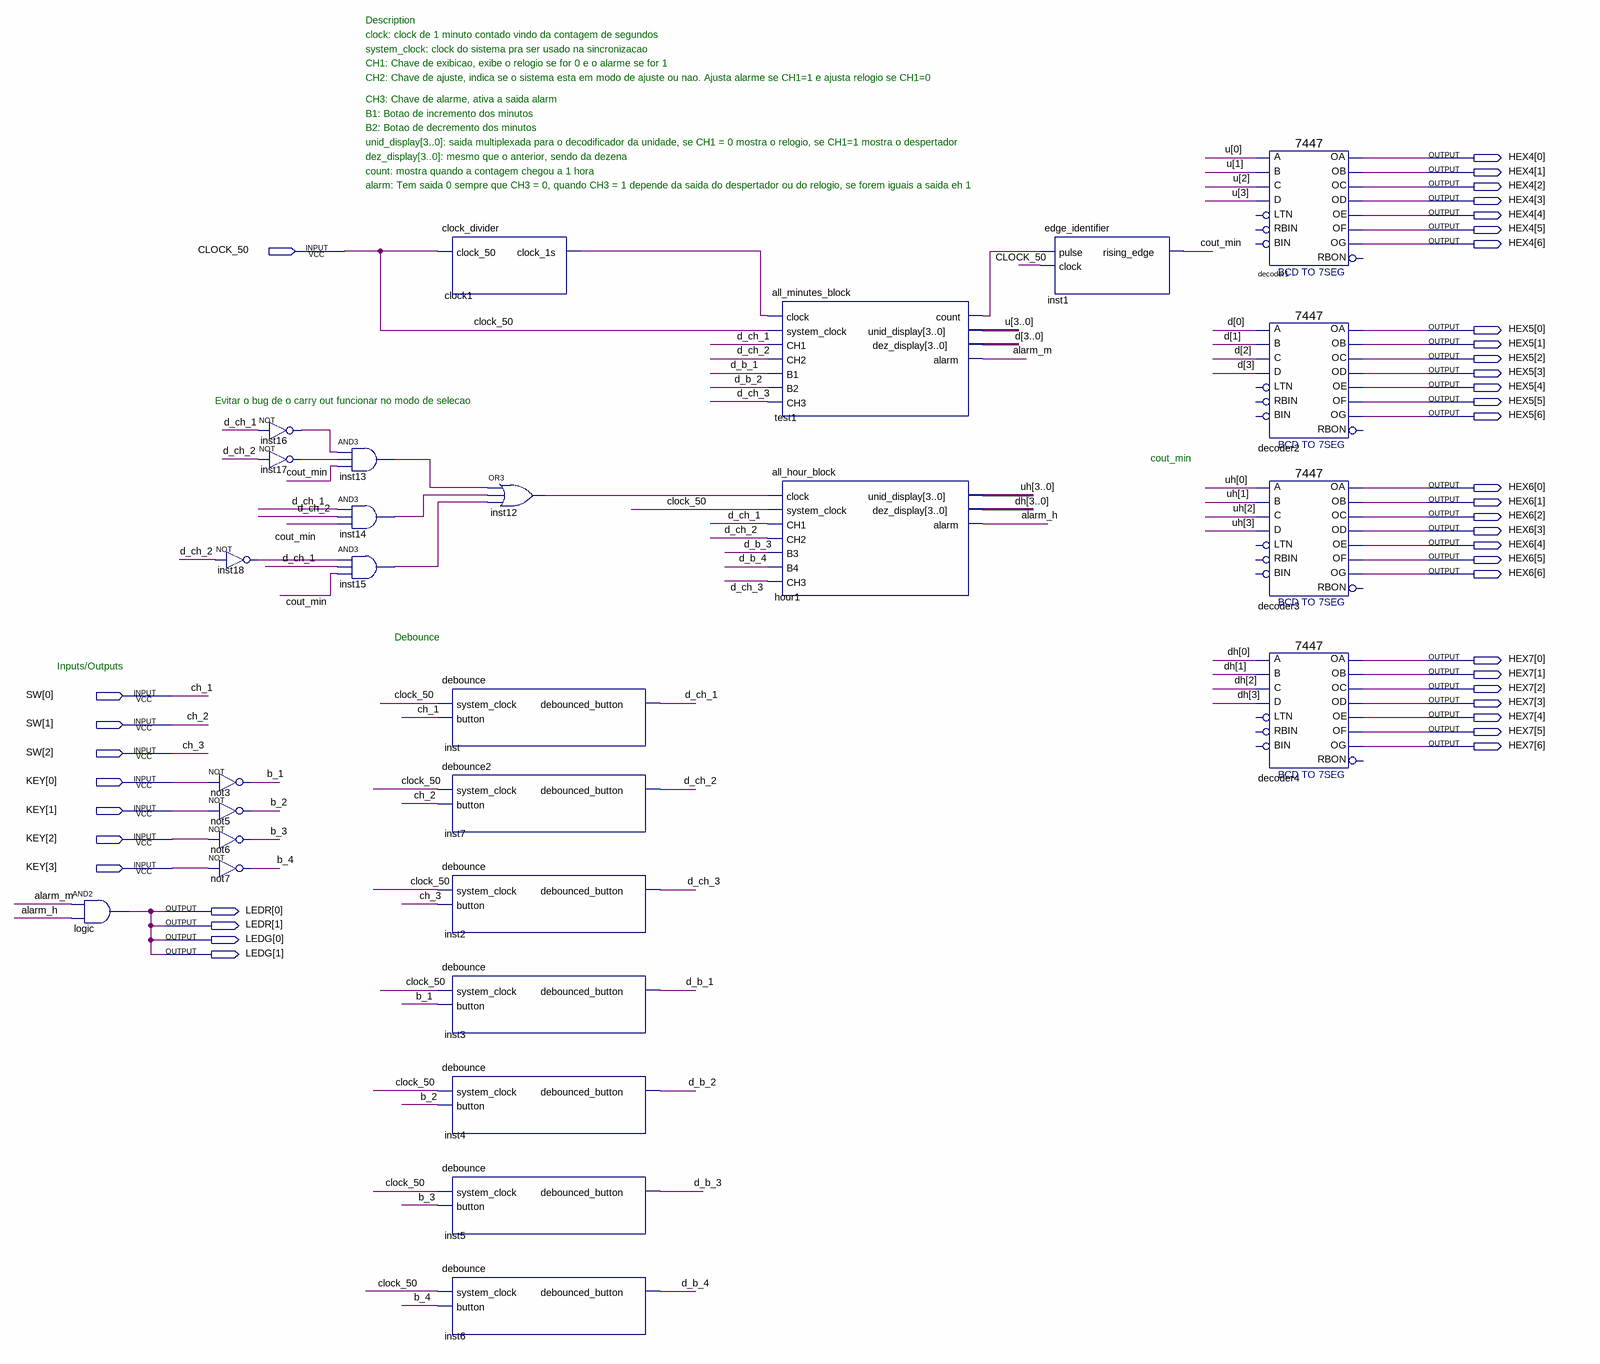
[diagram p0: schematic sheet]
// Quartus schematic digital_clock.bdf as structural Verilog: 27 symbols, 40 pins
module digital_clock (
  input  CLOCK_50,
  input  [2:0] SW,
  input  [3:0] KEY,
  output [6:0] HEX4,
  output [6:0] HEX5,
  output [6:0] HEX6,
  output [6:0] HEX7,
  output [1:0] LEDR,
  output [1:0] LEDG
);

  wire alarm_h, alarm_m, b_1, b_2, b_3, b_4, clock1_clock_1s, cout_min, d_b_1, d_b_2, d_b_3, d_b_4, d_ch_1,
       d_ch_2, d_ch_3, inst12_out, inst13_out, inst14_out, inst15_out, inst16_out, inst17_out, inst18_out,
       test1_count;
  wire [3:0] d, dh, u, uh;

  and \logic  (LEDG[1], alarm_m, alarm_h);
  not inst18 (inst18_out, d_ch_2);
  not not3 (b_1, KEY[0]);
  not not5 (b_2, KEY[1]);
  not not6 (b_3, KEY[2]);
  not not7 (b_4, KEY[3]);
  not inst16 (inst16_out, d_ch_1);
  not inst17 (inst17_out, d_ch_2);
  and inst13 (inst13_out, inst16_out, inst17_out, cout_min);
  and inst14 (inst14_out, d_ch_1, d_ch_2, cout_min);
  and inst15 (inst15_out, inst18_out, d_ch_1, cout_min);
  clock_divider clock1 (.clock_50(CLOCK_50), .clock_1s(clock1_clock_1s));
  debounce inst (.system_clock(CLOCK_50), .button(SW[0]), .debounced_button(d_ch_1));
  debounce2 inst7 (.system_clock(CLOCK_50), .button(SW[1]), .debounced_button(d_ch_2));
  debounce inst2 (.system_clock(CLOCK_50), .button(SW[2]), .debounced_button(d_ch_3));
  debounce inst3 (.system_clock(CLOCK_50), .button(b_1), .debounced_button(d_b_1));
  debounce inst4 (.system_clock(CLOCK_50), .button(b_2), .debounced_button(d_b_2));
  debounce inst5 (.system_clock(CLOCK_50), .button(b_3), .debounced_button(d_b_3));
  debounce inst6 (.system_clock(CLOCK_50), .button(b_4), .debounced_button(d_b_4));
  or inst12 (inst12_out, inst13_out, inst14_out, inst15_out);
  all_minutes_block test1 (
    .clock(clock1_clock_1s), .system_clock(CLOCK_50), .CH1(d_ch_1), .CH2(d_ch_2), .B1(d_b_1), .B2(d_b_2),
    .CH3(d_ch_3), .count(test1_count), .unid_display(u), .dez_display(d), .alarm(alarm_m));
  all_hour_block hour1 (
    .clock(inst12_out), .system_clock(CLOCK_50), .CH1(d_ch_1), .CH2(d_ch_2), .B3(d_b_3), .B4(d_b_4),
    .CH3(d_ch_3), .unid_display(uh), .dez_display(dh), .alarm(alarm_h));
  edge_identifier inst1 (.pulse(test1_count), .clock(CLOCK_50), .rising_edge(cout_min));
  \7447  decoder1 (
    .B(u[1]), .C(u[2]), .D(u[3]), .A(u[0]), .OB(HEX4[1]), .OC(HEX4[2]), .OE(HEX4[4]), .OD(HEX4[3]),
    .OF(HEX4[5]), .OG(HEX4[6]), .OA(HEX4[0]));  // open: LTN, RBIN, BIN, RBON
  \7447  decoder2 (
    .B(d[1]), .C(d[2]), .D(d[3]), .A(d[0]), .OB(HEX5[1]), .OC(HEX5[2]), .OE(HEX5[4]), .OD(HEX5[3]),
    .OF(HEX5[5]), .OG(HEX5[6]), .OA(HEX5[0]));  // open: LTN, RBIN, BIN, RBON
  \7447  decoder3 (
    .B(uh[1]), .C(uh[2]), .D(uh[3]), .A(uh[0]), .OB(HEX6[1]), .OC(HEX6[2]), .OE(HEX6[4]), .OD(HEX6[3]),
    .OF(HEX6[5]), .OG(HEX6[6]), .OA(HEX6[0]));  // open: LTN, RBIN, BIN, RBON
  \7447  decoder4 (
    .B(dh[1]), .C(dh[2]), .D(dh[3]), .A(dh[0]), .OB(HEX7[1]), .OC(HEX7[2]), .OE(HEX7[4]), .OD(HEX7[3]),
    .OF(HEX7[5]), .OG(HEX7[6]), .OA(HEX7[0]));  // open: LTN, RBIN, BIN, RBON

  assign LEDG[0] = LEDG[1];
  assign LEDR = {2{LEDG[1]}};

  // Other names for the same wires on the sheet: ch_1 = SW[0]; ch_2 = SW[1]; ch_3 = SW[2]

  // Notes on the sheet:
  //   Description
  //   clock: clock de 1 minuto contado vindo da contagem de segundos
  //   system_clock: clock do sistema pra ser usado na sincronizacao
  //   CH1: Chave de exibicao, exibe o relogio se for 0 e o alarme se for 1
  //   CH2: Chave de ajuste, indica se o sistema esta em modo de ajuste ou nao. Ajusta alarme se CH1=1 e ajusta relogio se CH1=0
  //   CH3: Chave de alarme, ativa a saida alarm
  //   B1: Botao de incremento dos minutos
  //   B2: Botao de decremento dos minutos
  //   unid_display[3..0]: saida multiplexada para o decodificador da unidade, se CH1 = 0 mostra o relogio, se CH1=1 mostra o despertador
  //   dez_display[3..0]: mesmo que o anterior, sendo da dezena
  //   count: mostra quando a contagem chegou a 1 hora
  //   alarm: Tem saida 0 sempre que CH3 = 0, quando CH3 = 1 depende da saida do despertador ou do relogio, se forem iguais a saida eh 1
  //   Evitar o bug de o carry out funcionar no modo de selecao
  //   cout_min
  //   Debounce
  //   Inputs/Outputs
endmodule
